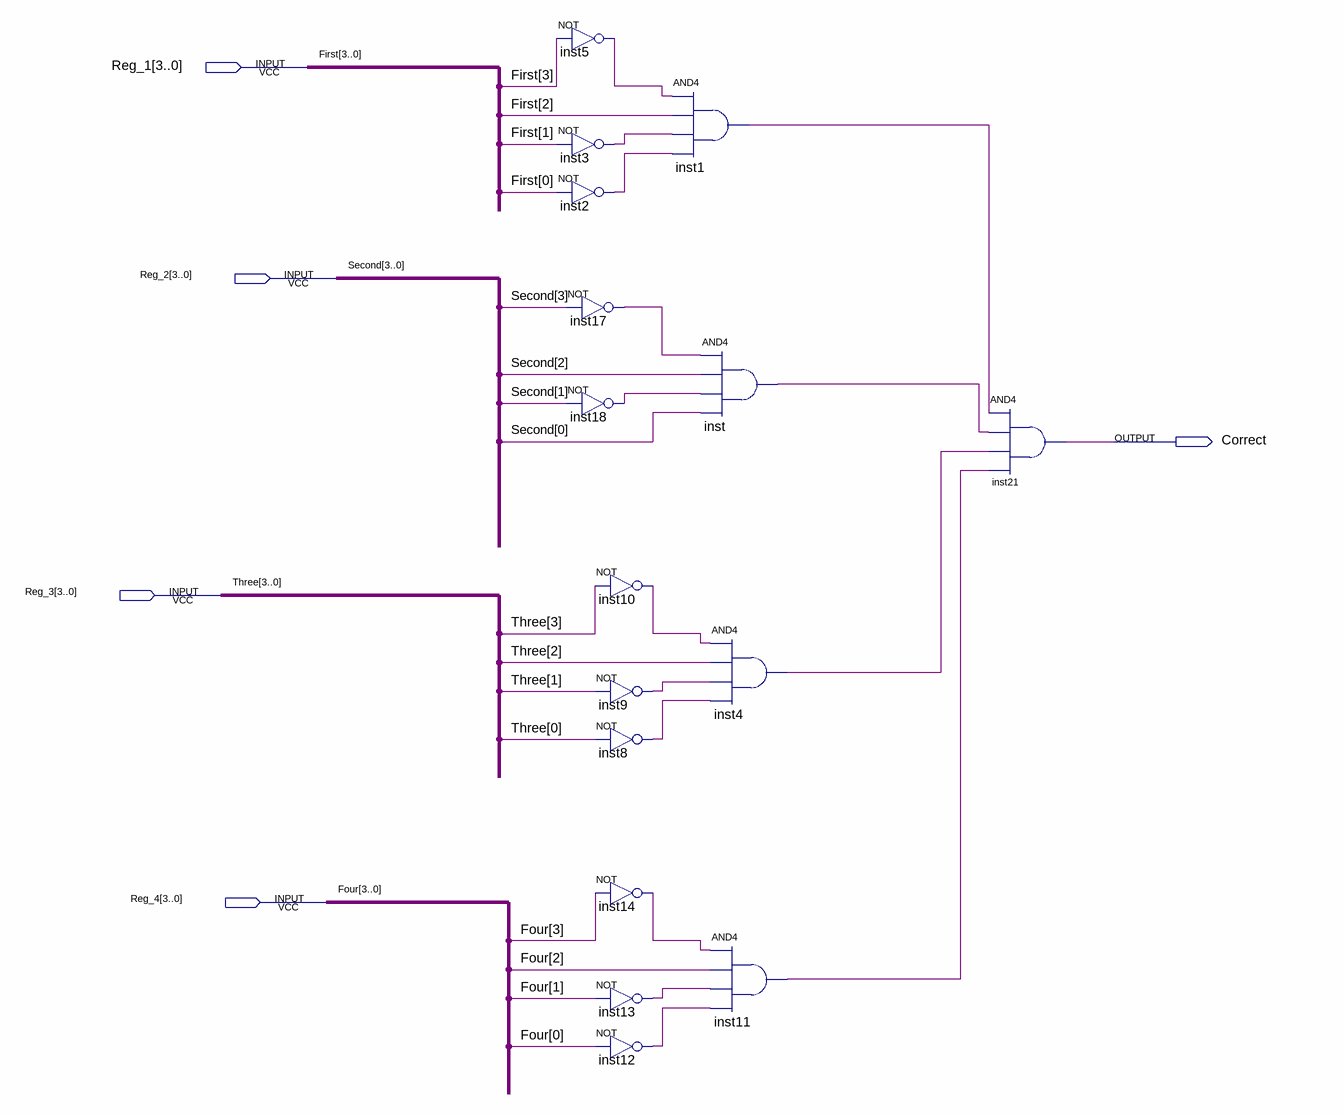
[diagram p0: schematic sheet]
// Quartus schematic Password.bdf as structural Verilog: 16 symbols, 5 pins
module Password (
  input  [3:0] Reg_1,
  input  [3:0] Reg_2,
  input  [3:0] Reg_3,
  input  [3:0] Reg_4,
  output Correct
);

  wire inst1_out, inst2_out, inst3_out, inst4_out, inst5_out, inst8_out, inst9_out, inst10_out, inst11_out,
       inst12_out, inst13_out, inst14_out, inst17_out, inst18_out, inst_out;

  not inst5 (inst5_out, Reg_1[3]);
  not inst3 (inst3_out, Reg_1[1]);
  not inst2 (inst2_out, Reg_1[0]);
  not inst17 (inst17_out, Reg_2[3]);
  not inst18 (inst18_out, Reg_2[1]);
  not inst10 (inst10_out, Reg_3[3]);
  not inst9 (inst9_out, Reg_3[1]);
  not inst8 (inst8_out, Reg_3[0]);
  not inst14 (inst14_out, Reg_4[3]);
  not inst13 (inst13_out, Reg_4[1]);
  not inst12 (inst12_out, Reg_4[0]);
  and inst1 (inst1_out, inst5_out, Reg_1[2], inst3_out, inst2_out);
  and inst (inst_out, inst17_out, Reg_2[2], inst18_out, Reg_2[0]);
  and inst4 (inst4_out, inst10_out, Reg_3[2], inst9_out, inst8_out);
  and inst11 (inst11_out, inst14_out, Reg_4[2], inst13_out, inst12_out);
  and inst21 (Correct, inst1_out, inst_out, inst4_out, inst11_out);

  // Other names for the same wires on the sheet: First[3:0] = Reg_1; Four[3:0] = Reg_4; Second[3:0] = Reg_2;
  //   Three[3:0] = Reg_3
endmodule
